# EAGLE design NanoIntrepid (EAGLE 7.5.0)
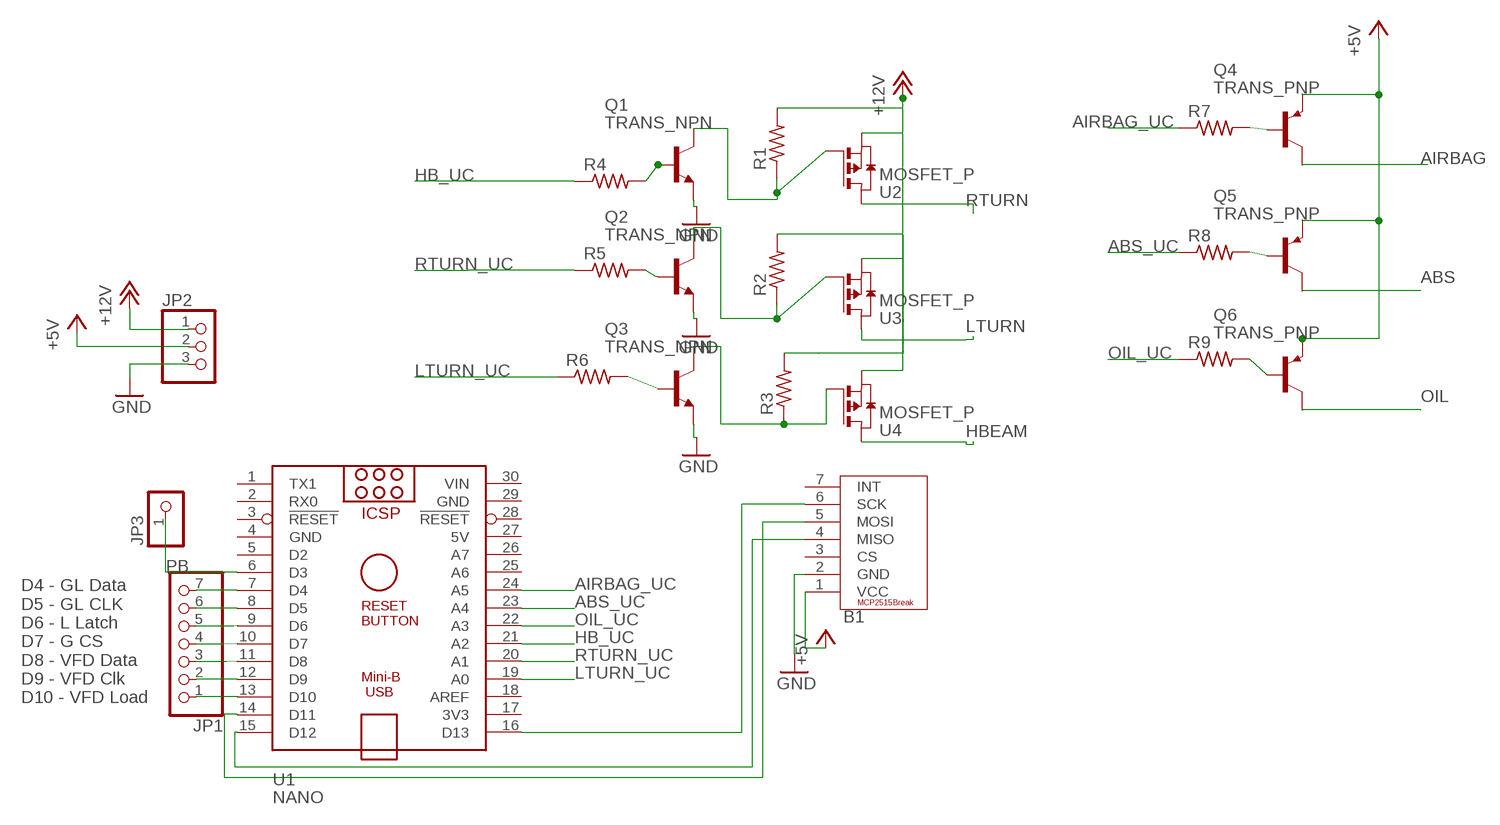
[diagram p0: schematic, sheet 1]

## Parts
B1  MCP2515_BREAKOUT  [MCP2515_BREAKOUT]
JP1  PINHD-1X7  [1X07]
JP2  PINHD-1X3  [1X03]
JP3  PINHD-1X1  [1X01]
Q1  TRANS_NPN  [SOT-23]
Q2  TRANS_NPN  [SOT-23]
Q3  TRANS_NPN  [SOT-23]
Q4  TRANS_PNP  [SOT-23]
Q5  TRANS_PNP  [SOT-23]
Q6  TRANS_PNP  [SOT-23]
R1  R-US_M1206  [M1206]
R2  R-US_M1206  [M1206]
R3  R-US_M1206  [M1206]
R4  R-US_M1206  [M1206]
R5  R-US_M1206  [M1206]
R6  R-US_M1206  [M1206]
R7  R-US_M1206  [M1206]
R8  R-US_M1206  [M1206]
R9  R-US_M1206  [M1206]
U1  NANO  [NANO]
U2  MOSFET_P  [SOT-23]
U3  MOSFET_P  [SOT-23]
U4  MOSFET_P  [SOT-23]

## Nets
+5V: B1.1(VCC) JP2.2 Q4.3(E) Q5.3(E) Q6.3(E)
+12V: JP2.1 R1.2 R2.2 R3.2 U2.2(S) U3.2(S) U4.2(S)
ABS: Q5.2(C)
ABS_UC: R8.1 U1.23(A4)
AIRBAG: Q4.2(C)
AIRBAG_UC: R7.1 U1.24(A5)
GND: B1.2(GND) JP2.3 Q1.2(E) Q2.2(E) Q3.2(E)
HB_UC: R4.1 U1.21(A2)
HBEAM: U4.3(D)
LTURN: U3.3(D)
LTURN_UC: R6.1 U1.19(A0)
N$1: B1.6(SCK) U1.16(D13)
N$2: B1.4(MISO) U1.15(D12)
N$3: B1.5(MOSI) U1.14(D11)
N$4: JP1.7 U1.7(D4)
N$5: JP1.6 U1.8(D5)
N$6: JP1.5 U1.9(D6)
N$7: JP1.4 U1.10(D7)
N$8: JP1.3 U1.11(D8)
N$9: JP1.2 U1.12(D9)
N$10: JP1.1 U1.13(D10)
N$11: Q2.1(B) R5.2
N$12: Q1.1(B) R4.2
N$13: Q1.3(C) R1.1 U2.1(G)
N$14: Q2.3(C) R2.1 U3.1(G)
N$16: Q3.3(C) R3.1 U4.1(G)
N$17: Q3.1(B) R6.2
N$22: Q4.1(B) R7.2
N$23: Q5.1(B) R8.2
N$24: Q6.1(B) R9.2
OIL: Q6.2(C)
OIL_UC: R9.1 U1.22(A3)
PB: JP3.1 U1.6(D3)
RTURN: U2.3(D)
RTURN_UC: R5.1 U1.20(A1)
Unconnected: B1.3(CS) B1.7(INT) U1.1(TX1) U1.2(RX0) U1.3(!RESET) U1.5(D2) U1.17(3V3) U1.18(AREF) U1.25(A6) U1.26(A7) U1.28(!RESET)

## Notes on the sheet
- D4 - GL Data
  D5 - GL CLK
  D6 - L Latch
  D7 - G CS
  D8 - VFD Data
  D9 - VFD Clk
  D10 - VFD Load

## Power pins joined to a net without a drawn wire
5V: U1.27(5V)
GND: U1.4(GND) U1.29(GND)
VIN: U1.30(VIN)

## Library data of the parts
B1 = DR:MCP2515_BREAKOUT: MCP2515 Breakout Board
JP1 = pinhead:PINHD-1X7: PIN HEADER
JP2 = pinhead:PINHD-1X3: PIN HEADER
JP3 = pinhead:PINHD-1X1: PIN HEADER
Q1-Q3 = DR:TRANS_NPN: Transistor, NPN
Q4-Q6 = DR:TRANS_PNP
R1-R9 = DR:R-US_: RESISTOR, American symbol
U1 = DR:NANO
U2-U4 = DR:MOSFET_P

## Board
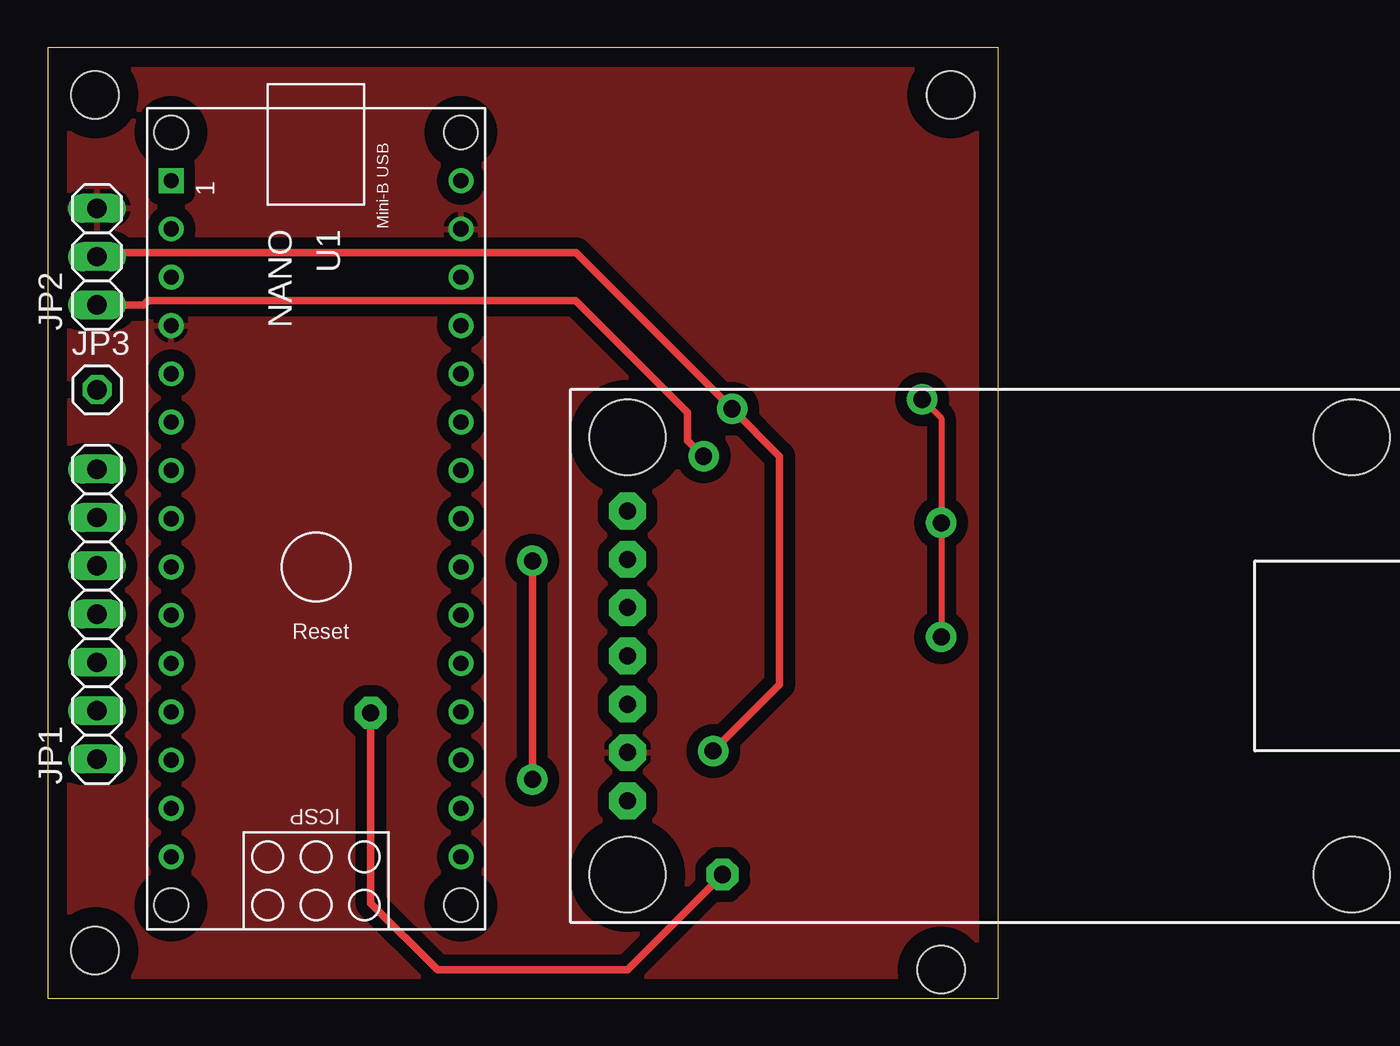
[diagram p1: board, top side]
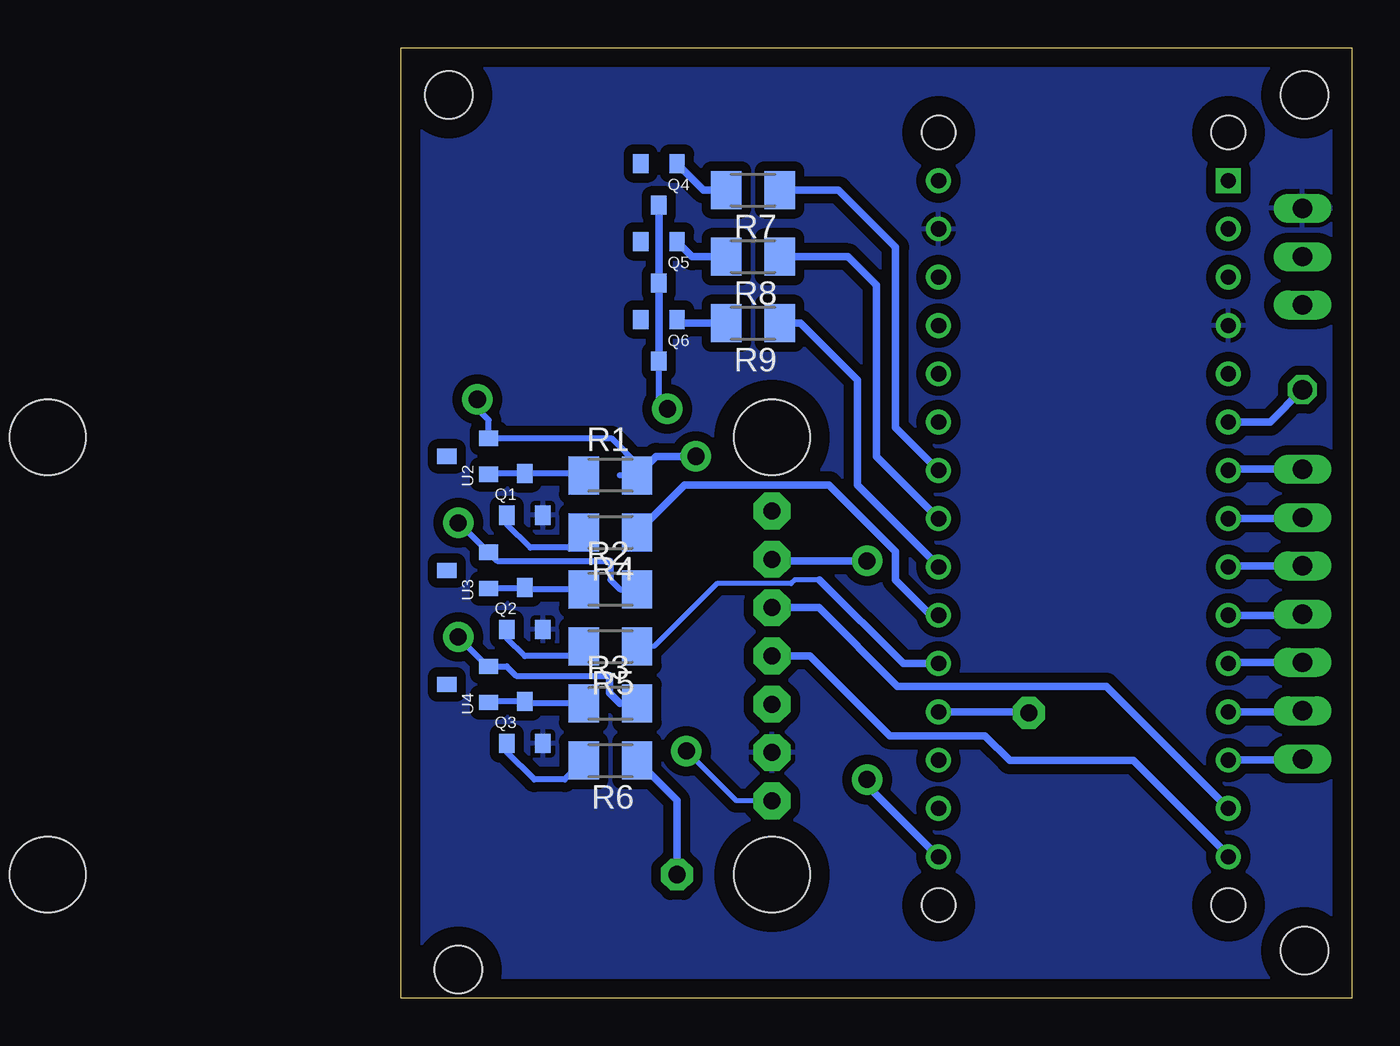
[diagram p2: board, bottom side, seen from below]

Size 50 x 50 mm. Coordinates in mm from the lower left corner, seen from the top.
Outline: 0,0 50,0 50,50 0,50 0,0
Copper layers (1*16): Top 0.035mm / dielectric 1.5mm / Bottom 0.035mm
Design rules "default": minimum track width 10mil, minimum drill 24mil, track to track 8mil, track to pad 8mil, pad to pad 8mil, via to via 8mil, smd to smd 8mil, copper to edge 40mil, drill to drill 8mil, minimum pad ring 10mil, minimum via ring 8mil, stop-mask expansion 4mil, vias tented up to drill 0mil, thermal gap 10mil
Holes 2.5 mm at 2.5,2.5 2.5,47.5 47,1.5 47.5,47.5

### Footprints (pad centres in the part's own frame; a part is rotated, then mirrored left to right if it is on the bottom)
MCP2515_BREAKOUT = drill 0.9 pad 1.93 octagon: 1 0,-7.62; 2 0,-5.08; 3 0,-2.54; 4 0,0; 5 0,2.54; 6 0,5.08; 7 0,7.62 | hole 4: 0,11.5; 0,-11.5; 38.1,11.5; 38.1,-11.5
1X07 = drill 1.016 long: 1 -7.62,0; 2 -5.08,0; 3 -2.54,0; 4 0,0; 5 2.54,0; 6 5.08,0; 7 7.62,0
1X03 = drill 1.016 long: 1 -2.54,0; 2 0,0; 3 2.54,0
1X01 = drill 1.016 octagon: 1 0,0
SOT-23 = smd 0.8 x 1: 1 -0.95,-2.1; 2 0.95,-2.1; 3 0,0.1
M1206 = smd 1.6 x 2: 1 -1.4,0; 2 1.4,0
NANO = drill 0.8 square: 1 0,0 | drill 0.8: 2 2.54,0; 3 5.08,0; 4 7.62,0; 5 10.16,0; 6 12.7,0; 7 15.24,0; 8 17.78,0; 9 20.32,0; 10 22.86,0; 11 25.4,0; 12 27.94,0; 13 30.48,0; 14 33.02,0; 15 35.56,0; 16 35.56,15.24; 17 33.02,15.24; 18 30.48,15.24; 19 27.94,15.24; 20 25.4,15.24; 21 22.86,15.24; 22 20.32,15.24; 23 17.78,15.24; 24 15.24,15.24; 25 12.7,15.24; 26 10.16,15.24; 27 7.62,15.24; 28 5.08,15.24; 29 2.54,15.24; 30 0,15.24 | hole 1.778: -2.54,0; -2.54,15.24; 38.1,15.24; 38.1,0

### Placement (x,y rotation side)
B1  30.5,18 0 top
JP1  2.6,20.2 90 top
JP2  2.6,39 90 top
JP3  2.6,32 0 top
Q1  43.5,27.5 0 bottom
Q2  43.5,21.5 0 bottom
Q3  43.5,15.5 0 bottom
Q4  36.45,41.8 180 bottom
Q5  36.45,37.7 180 bottom
Q6  36.45,33.6 180 bottom
R1  39,27.5 0 bottom
R2  39,21.5 0 bottom
R3  39,15.5 0 bottom
R4  39,24.5 180 bottom
R5  39,18.5 180 bottom
R6  39,12.5 180 bottom
R7  31.5,42.5 180 bottom
R8  31.5,39 180 bottom
R9  31.5,35.5 180 bottom
U1  6.5,43 270 top
U2  47.5,28.5 90 bottom
U3  47.5,22.5 90 bottom
U4  47.5,16.5 90 bottom

### Tracks (layer width: path | path; a pad name or v marks a point on that pad's centre or on a via)
+5V  (via drill 0.9 pad 1.6)
  Top 0.305: JP2.2 2.8,39.2
  Top 0.406: v35,13 38.5,16.5 38.5,28.5 v36,31 27.8,39.2 2.8,39.2
  Bottom 0.254: B1.1 32.38,10.38 v35,13
  Bottom 0.305: v36,31 36.45,31.45 Q6.3
  Bottom 0.406: Q4.3 Q5.3 Q6.3
+12V  (via drill 0.9 pad 1.6)
  Top 0.305: v46,31.5 47,30.5 47,25.5 v47,25 v47,19
  Top 0.406: JP2.1 5.06,36.46 5.3,36.7 27.78,36.7 33.67,30.81 33.67,29.33 v34.5,28.5
  Bottom 0.305: 38.5,27.5 R1.2 37.5,27.6 37.5,28 38.95,29.45 U2.2 45.4,30.4 46,31 v46,31.5 | 39,23 39,22 38.5,21.5 R2.2 | R3.2 38.5,15.5 | 39.05,22.95 39,23 | 39,17 39.05,16.95 43.95,16.95 44.45,17.45 U4.2 45.45,17.45 v47,19 | 39,23 44.95,23 U3.2 46.95,25 v47,25
  Bottom 0.406: R1.2 36.6,28.5 v34.5,28.5 | 38.5,15.5 39.05,16.05 39.05,16.95
ABS_UC
  Bottom 0.406: U1.23 21.74,25.24 25,28.5 25,37.5 26.5,39 R8.1
AIRBAG_UC
  Bottom 0.406: U1.24 21.76,27.76 24,30 24,39.5 27,42.5 R7.1
GND
  pour Bottom (isolate 0.5): -0.5,50.5 54.5,50.5 54.5,0 -0.5,0
  pour Top (isolate 0.61): -1,50.5 51,50.5 51,-0.5 -1,-0.5
HB_UC
  Bottom 0.406: U1.21 22.14,20.14 24,22 24,23.5 27.5,27 35.1,27 R4.1
LTURN_UC  (via drill 0.9 pad 1.68)
  Top 0.406: v17,15 17,5 20.5,1.5 30.5,1.5 v35.5,6.5
  Bottom 0.406: U1.19 17.06,15.06 v17,15 | v35.5,6.5 35.5,10.4 R6.1
N$1  (via drill 0.9 pad 1.6)
  Top 0.406: v25.5,11.5 v25.5,23
  Bottom 0.406: U1.16 25.5,11.2 v25.5,11.5 | v25.5,23 30.42,23 B1.6
N$2
  Bottom 0.406: B1.4 28.5,18 24.3,13.8 19.3,13.8 18,12.5 11.5,12.5 6.5,7.5 U1.15
N$3
  Bottom 0.406: U1.14 12.92,16.4 23.9,16.4 28.04,20.54 B1.5
N$4
  Bottom 0.406: JP1.7 6.44,27.82 U1.7
N$5
  Bottom 0.406: U1.8 2.66,25.22 JP1.6
N$6
  Bottom 0.406: JP1.5 6.44,22.74 U1.9
N$7
  Bottom 0.406: U1.10 2.66,20.14 JP1.4
N$8
  Bottom 0.406: JP1.3 6.44,17.66 U1.11
N$9
  Bottom 0.406: U1.12 2.66,15.06 JP1.2
N$10
  Bottom 0.406: U1.13 2.66,12.52 JP1.1
N$11
  Bottom 0.305: R5.2 40.9,18 43.5,18 44.45,18.95 Q2.1
N$12
  Bottom 0.305: R4.2 41.2,23.7 43.2,23.7 44.45,24.95 Q1.1
N$13
  Bottom 0.305: R1.1 40.5,27.6 Q1.3 45.35,27.6 U2.1
N$14
  Bottom 0.305: Q2.3 43.55,21.55 | 43.55,21.55 U3.1 | R2.1 43.5,21.5 43.55,21.55
N$16
  Bottom 0.305: R3.1 43.4,15.5 Q3.3 45.35,15.6 U4.1
N$17
  Bottom 0.305: R6.2 41.4,11.5 43,11.5 44.45,12.95 Q3.1
N$22
  Bottom 0.406: R7.2 34.1,42.5 Q4.1
N$23
  Bottom 0.406: R8.2 34.7,39 Q5.1
N$24
  Bottom 0.406: R9.2 35.3,35.5 Q6.1
OIL_UC
  Bottom 0.406: U1.22 21.74,22.74 26,27 26,32.5 29,35.5 R9.1
PB
  Bottom 0.406: U1.6 4.3,30.3 JP3.1
RTURN_UC
  Bottom 0.254: 28,22 29.3,22 29.5,21.8 33.4,21.8 36.7,18.5 R5.1
  Bottom 0.406: U1.20 23.6,17.6 28,22